# EAGLE design haasoscope_pro_preinput_board (EAGLE 9.6.2)
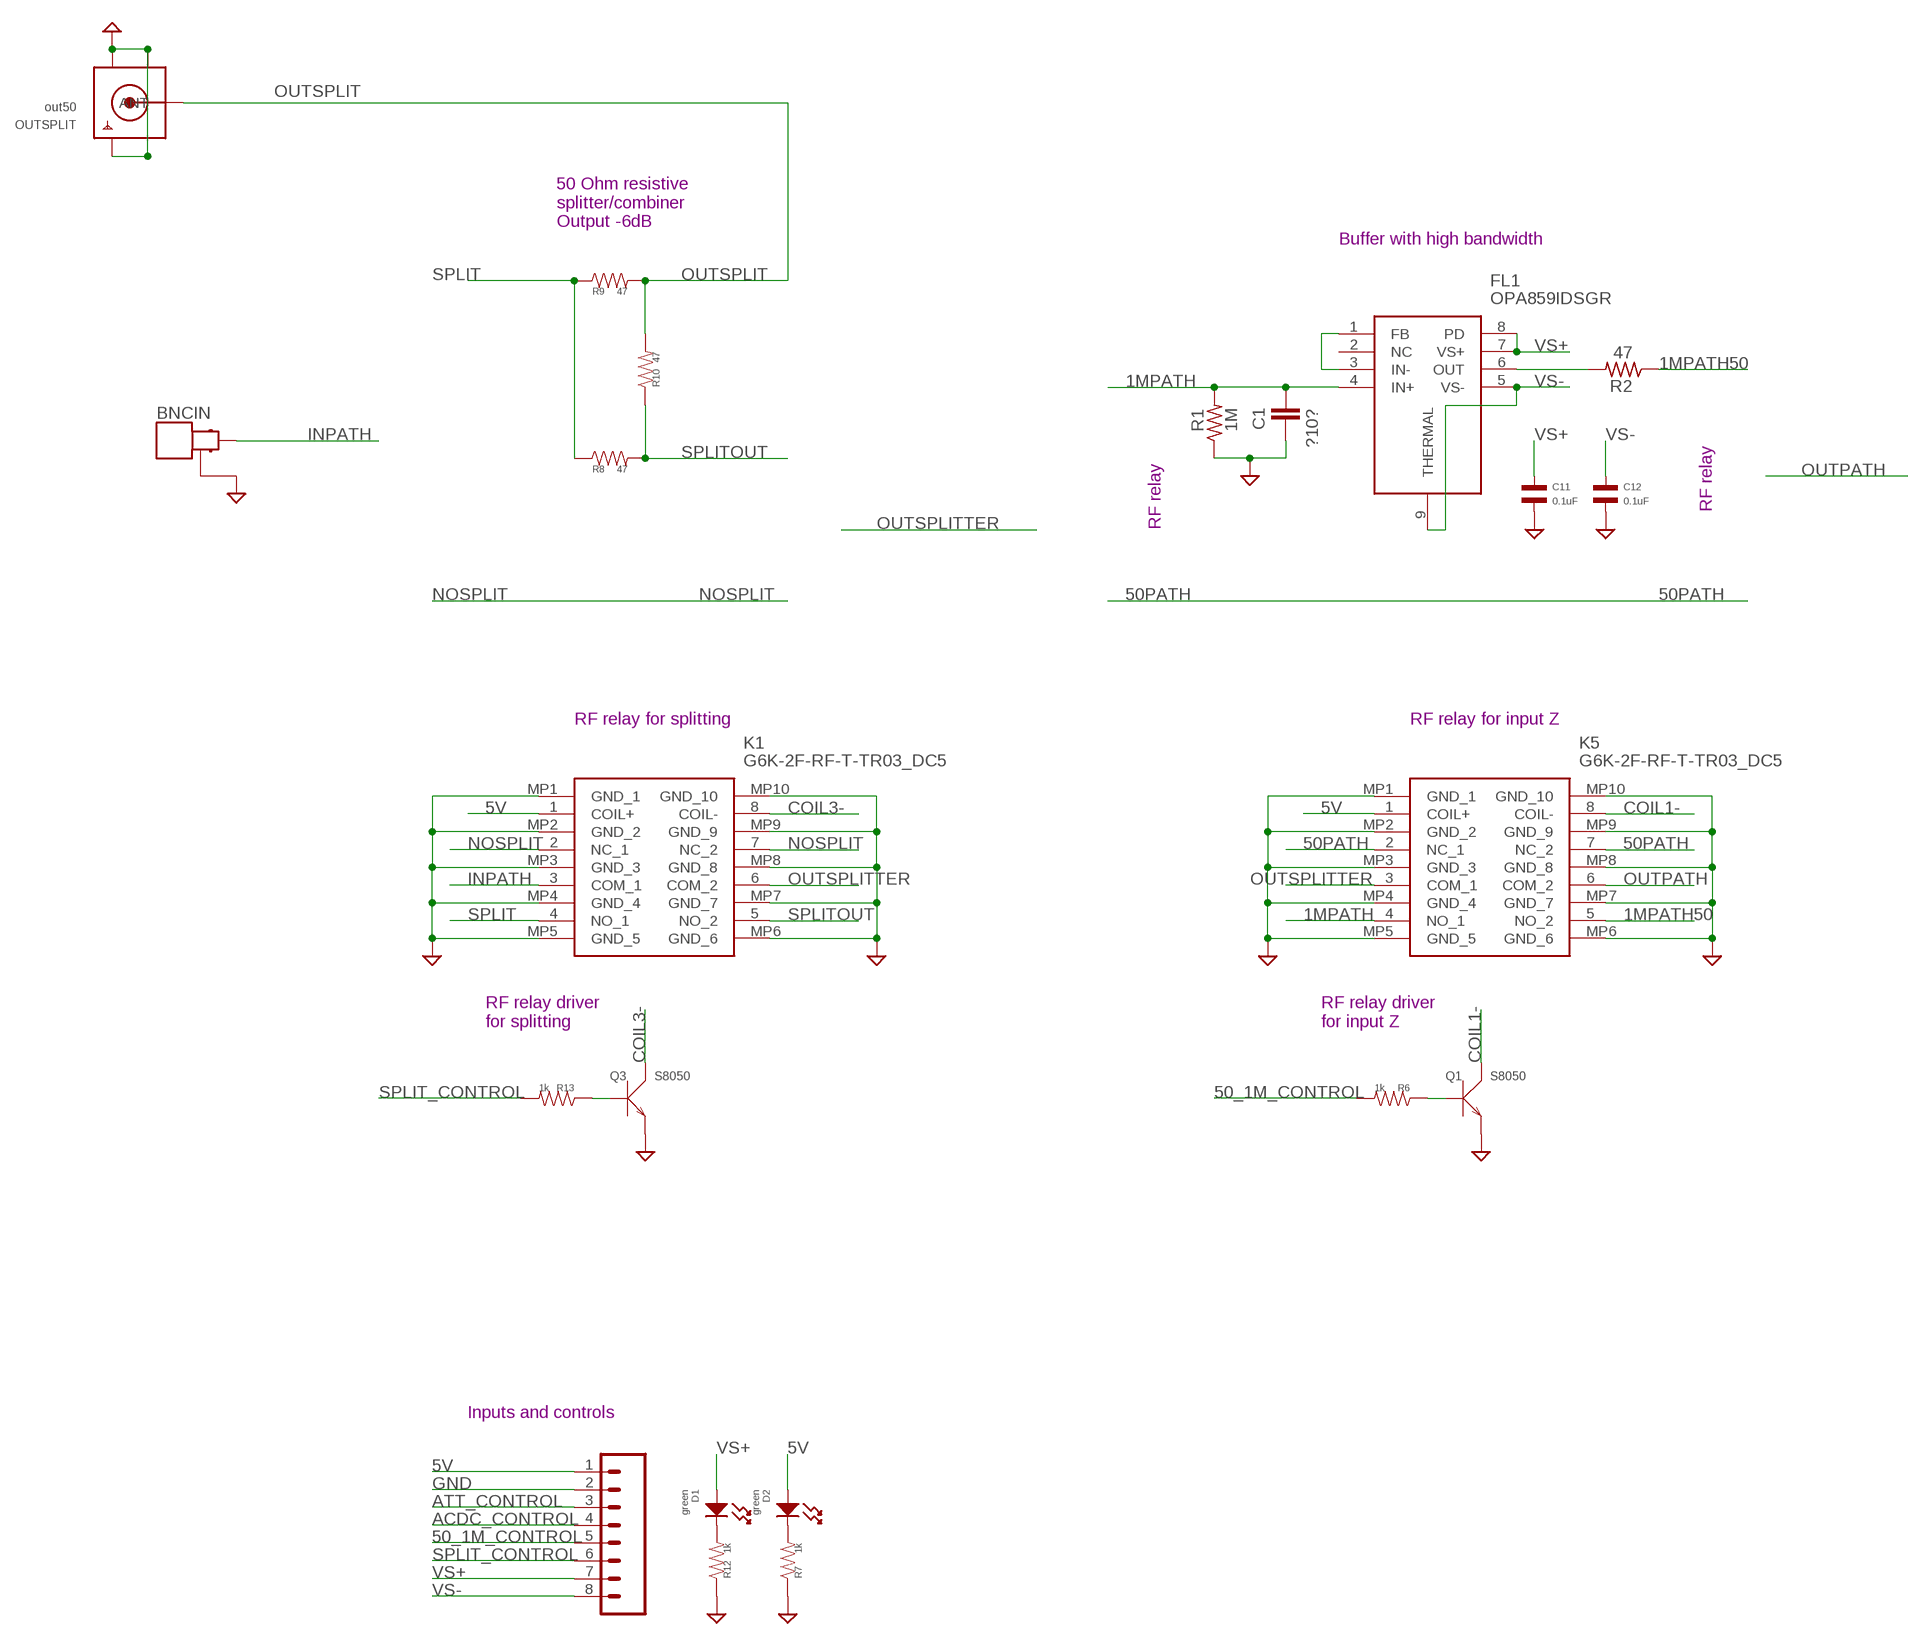
[diagram p0: schematic, sheet 1, part 1 of 2]
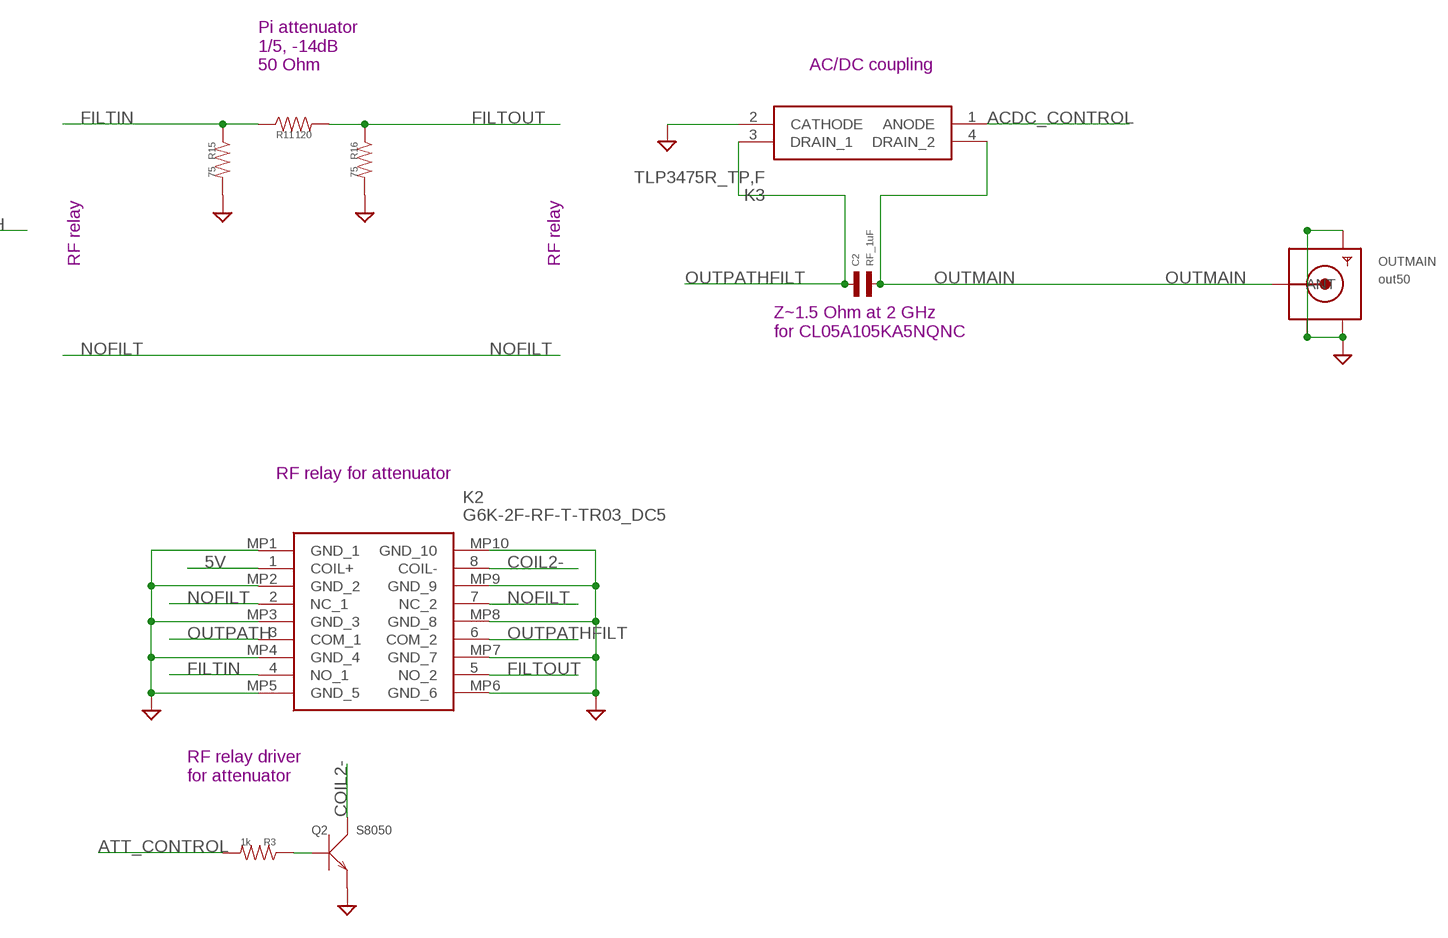
[diagram p1: schematic, sheet 1, part 2 of 2]

## Parts
BNCIN  MOLEX_BNC_73100-0105  [MOLEX-BNC-73100-0105]
C1  ?10?  C-EUC0805  [C0805]
C2  RF_1uF  CAPACITOR_NP_0402  [C0402]
C11  0.1uF  CAPACITOR_NP_0402  [C0402]
C12  0.1uF  CAPACITOR_NP_0402  [C0402]
D1  green  LED_SINGLE-0603  [LED0603]
D2  green  LED_SINGLE-0603  [LED0603]
FL1  OPA859IDSGR  [SON50P200X200X80-9N]
J4  8pin  CONN_08"  [1X08]
K1  G6K-2F-RF-T-TR03_DC5  [G6K2FRFTTR03DC5]
K2  G6K-2F-RF-T-TR03_DC5  [G6K2FRFTTR03DC5]
K3  TLP3475R_TP,F  [TLP3475RTPF]
K5  G6K-2F-RF-T-TR03_DC5  [G6K2FRFTTR03DC5]
OUTMAIN  out50  SMACONNECTOR_EDGE  [SMA_EDGELAUNCH]
OUTSPLIT  out50  SMACONNECTOR_EDGE  [SMA_EDGELAUNCH]
Q1  S8050  SMD-TRANSISTORS-NPN-25V-500MW-S8050(SOT-23)  [SOT-23]
Q2  S8050  SMD-TRANSISTORS-NPN-25V-500MW-S8050(SOT-23)  [SOT-23]
Q3  S8050  SMD-TRANSISTORS-NPN-25V-500MW-S8050(SOT-23)  [SOT-23]
R1  1M  R-US_R0805  [R0805]
R2  47  R-US_R0805  [R0805]
R3  1k  RESISTOR_0402  [R0402]
R6  1k  RESISTOR_0402  [R0402]
R7  1k  RESISTOR_0402  [R0402]
R8  47  RESISTOR_0402  [R0402]
R9  47  RESISTOR_0402  [R0402]
R10  47  RESISTOR_0402  [R0402]
R11  120  RESISTOR_0402  [R0402]
R12  1k  RESISTOR_0402  [R0402]
R13  1k  RESISTOR_0402  [R0402]
R15  75  RESISTOR_0402  [R0402]
R16  75  RESISTOR_0402  [R0402]

## Nets
1MPATH: C1.2 FL1.4(IN+) K5.4(NO_1) R1.2
1MPATH50: K5.5(NO_2) R2.1
5V: D2.ANODE J4.1 K1.1(COIL+) K2.1(COIL+) K5.1(COIL+)
50_1M_CONTROL: J4.5 R6.P$2
50PATH: K5.2(NC_1) K5.7(NC_2)
ACDC_CONTROL: J4.4 K3.1(ANODE)
ATT_CONTROL: J4.3 R3.P$2
COIL1-: K5.8(COIL-) Q1.3(C)
COIL2-: K2.8(COIL-) Q2.3(C)
COIL3-: K1.8(COIL-) Q3.3(C)
FILTIN: K2.4(NO_1) R11.P$1 R15.P$1
FILTOUT: K2.5(NO_2) R11.P$2 R16.P$1
GND: BNCIN.GND1(GND) BNCIN.GND2(GND) C1.1 C11.P$2 C12.P$2 J4.2 K1.MP1(GND_1) K1.MP2(GND_2) K1.MP3(GND_3) K1.MP4(GND_4) K1.MP5(GND_5) K1.MP6(GND_6) K1.MP7(GND_7) K1.MP8(GND_8) K1.MP9(GND_9) K1.MP10(GND_10) K2.MP1(GND_1) K2.MP2(GND_2) K2.MP3(GND_3) K2.MP4(GND_4) K2.MP5(GND_5) K2.MP6(GND_6) K2.MP7(GND_7) K2.MP8(GND_8) K2.MP9(GND_9) K2.MP10(GND_10) K3.2(CATHODE) K5.MP1(GND_1) K5.MP2(GND_2) K5.MP3(GND_3) K5.MP4(GND_4) K5.MP5(GND_5) K5.MP6(GND_6) K5.MP7(GND_7) K5.MP8(GND_8) K5.MP9(GND_9) K5.MP10(GND_10) OUTMAIN.GND@1(GND4) OUTMAIN.GND@2(GND3) OUTMAIN.GND@3(GND2) OUTMAIN.GND@4(GND1) OUTSPLIT.GND@1(GND4) OUTSPLIT.GND@2(GND3) OUTSPLIT.GND@3(GND2) OUTSPLIT.GND@4(GND1) Q1.2(E) Q2.2(E) Q3.2(E) R1.1 R7.P$1 R12.P$1 R15.P$2 R16.P$2
INPATH: BNCIN.SIGNAL K1.3(COM_1)
N$1: D1.CATHODE R12.P$2
N$2: Q2.1(B) R3.P$1
N$3: Q3.1(B) R13.P$1
N$4: FL1.6(OUT) R2.2
N$5: FL1.1(FB) FL1.3(IN-)
N$6: Q1.1(B) R6.P$1
N$7: D2.CATHODE R7.P$2
NOFILT: K2.2(NC_1) K2.7(NC_2)
NOSPLIT: K1.2(NC_1) K1.7(NC_2)
OUTMAIN: C2.P$2 K3.4(DRAIN_2) OUTMAIN.P(ANT)
OUTPATH: K2.3(COM_1) K5.6(COM_2)
OUTPATHFILT: C2.P$1 K2.6(COM_2) K3.3(DRAIN_1)
OUTSPLIT: OUTSPLIT.P(ANT) R9.P$2 R10.P$2
OUTSPLITTER: K1.6(COM_2) K5.3(COM_1)
SPLIT: K1.4(NO_1) R8.P$1 R9.P$1
SPLIT_CONTROL: J4.6 R13.P$2
SPLITOUT: K1.5(NO_2) R8.P$2 R10.P$1
VS+: C11.P$1 D1.ANODE FL1.7(VS+) FL1.8(PD) J4.7
VS-: C12.P$1 FL1.5(VS-) FL1.9(THERMAL) J4.8
Unconnected: FL1.2(NC)

## Notes on the sheet
- 50 Ohm resistive 
  splitter/combiner
  Output -6dB
- Buffer with high bandwidth
- Pi attenuator
  1/5, -14dB
  50 Ohm
- AC/DC coupling
- RF relay | RF relay | RF relay
- RF relay
- Z~1.5 Ohm at 2 GHz
  for CL05A105KA5NQNC
- RF relay for splitting | RF relay for input Z | RF relay for attenuator
- RF relay driver
  for splitting
- RF relay driver
  for input Z
- RF relay driver
  for attenuator
- Inputs and controls

## Library data of the parts
BNCIN = connector:MOLEX_BNC_73100-0105: CONN BNC JACK R/A 50 OHM PCB; DIGIKEY: WM5524-ND; MPN: 73100-0105
C1 = resistor:C-EU: CAPACITOR, European symbol
C2 = MF_Passives:CAPACITOR_NP: Library: MF_Passives Description: Device for Non-Polarized Capacitors. Manufacture part number (MPN) can be added via Attributes. Check https://factory.macrofab.com/parts for the house parts list.; LCSC: C52923; POPULATE: 1
C11 C12 = MF_Passives:CAPACITOR_NP: Library: MF_Passives Description: Device for Non-Polarized Capacitors. Manufacture part number (MPN) can be added via Attributes. Check https://factory.macrofab.com/parts for the house parts list.; POPULATE: 1
D1 D2 = MF_LEDs:LED_SINGLE: Library: MF_LEDs Description: Device for Single LED Packages. Manufacture part number (MFG#) can be added via Attributes.; HOUSEPART: NO; LCSC: C2286; POPULATE: 1
FL1 = OPA859IDSGR:OPA859IDSGR: 1.8 GHz Unity-Gain Bandwidth, 3.3 nV/Hz, FET Input Amplifier Source: Datasheet <http://www.ti.com/lit/gpn/opa859>; DESCRIPTION: 1.8 GHz Unity-Gain Bandwidth, 3.3 nV/Hz, FET Input Amplifier; HEIGHT: 0.8mm; MANUFACTURER_NAME: Texas Instruments; MANUFACTURER_PART_NUMBER: OPA859IDSGR; MOUSER_PART_NUMBER: 595-OPA859IDSGR; MOUSER_PRICE-STOCK: https://www.mouser.co.uk/ProductDetail/Texas-Instruments/OPA859IDSGR?qs=qSfuJ%252Bfl%2Fd54IFp3Wwx4ug%3D%3D
J4 = SparkFun-Connectors:CONN_08: Multi connection point. Often used as Generic Header-pin footprint for 0.1 inch spaced/style header connections On any of the 0.1 inch spaced packages, you can populate with these: Break Away Headers - Straight <https://www.sparkfun.com/products/116> (PRT-00116) Break Away Male Headers - Right Angle <https://www.sparkfun.com/products/553> (PRT-00553) Female Headers <https://www.sparkfun.com/products/115> (PRT-00115) Break Away Headers - Machine Pin <https://www.sparkfun.com/products/117> (PRT-00117) Break Away Female Headers - Swiss Machine Pin <https://www.sparkfun.com/products/743> (PRT-00743) Arduino Stackable Header - 8 Pin <https://www.sparkfun.com/products/9279> (PRT-09279) For SCREWTERMINALS and SPRING TERMINALS visit here: Screw Terimnals on SparkFun.com <https://www.sparkfun.com/search/results?term=Screw+Terminals> (5mm/3.5mm/2.54mm spacing) This device is also useful as a general connection point to wire up your design to another part of your project. Our various solder wires solder well into these plated through hole pads. Hook-Up Wire - Assortment (Stranded, 22 AWG) <https://www.sparkfun.com/products/11375> (PRT-11375) Hook-Up Wire - Assortment (Solid Core, 22 AWG) <https://www.sparkfun.com/products/11367> (PRT-11367) View the entire wire category on our website here <https://www.sparkfun.com/categories/141> Special notes: Molex polarized connector foot print use with SKU : PRT-08231 with associated crimp pins and housings. 1MM SMD Version SKU: PRT-10208 NOTES ON THE VARIANTS LOCK and LOCK_LONGPADS... This footprint was designed to help hold the alignment of a through-hole component (i.e. 6-pin header) while soldering it into place. You may notice that each hole has been shifted either up or down by 0.005 of an inch from it's more standard position (which is a perfectly straight line). This slight alteration caused the pins (the squares in the middle) to touch the edges of the holes. Because they are alternating, it causes a "brace" to hold the component in place. 0.005 has proven to be the perfect amount of "off-center" position when using our standard breakaway headers. Although looks a little odd when you look at the bare footprint, once you have a header in there, the alteration is very hard to notice. Also,if you push a header all the way into place, it is covered up entirely on the bottom side.; PROD_ID: CONN-08438
K1 K2 K5 = G6K-2F-RF-T-TR03_DC5:G6K-2F-RF-T-TR03_DC5: High Frequency / RF Relays 3GHz SpSavGrd NoLtch DPDT 5DC 100mW TR300 Source: Datasheet <http://omronfs.omron.com/en_US/ecb/products/pdf/en-g6k_2f_rf.pdf>; DESCRIPTION: High Frequency / RF Relays 3GHz SpSavGrd NoLtch DPDT 5DC 100mW TR300; HEIGHT: 5.7mm; MANUFACTURER_NAME: Omron Electronics; MANUFACTURER_PART_NUMBER: G6K-2F-RF-T-TR03 DC5; MOUSER_PART_NUMBER: 653-G6K2FRFTTR03DC5; MOUSER_PRICE-STOCK: https://www.mouser.co.uk/ProductDetail/Omron-Electronics/G6K-2F-RF-T-TR03-DC5?qs=bR9%2Fh8%2FHa7Q3LGohyKHVjA%3D%3D
K3 = TLP3475R_TP_F:TLP3475R_TP,F: Solid State Relays - PCB Mount Photorelay Voff=40V Ion=0.12A Ron=14Ohm Source: Datasheet <https://toshiba.semicon-storage.com/info/docget.jsp?did=15250&prodName=TLP3475R>; DESCRIPTION: Solid State Relays - PCB Mount Photorelay Voff=40V Ion=0.12A Ron=14Ohm; HEIGHT: 1.4mm; MANUFACTURER_NAME: Toshiba; MANUFACTURER_PART_NUMBER: TLP3475R(TP,F; MOUSER_PART_NUMBER: 757-TLP3475RTPF; MOUSER_PRICE-STOCK: https://www.mouser.co.uk/ProductDetail/Toshiba/TLP3475RTPF?qs=bYcAidFZG4jqnlmzhh150Q%3D%3D
OUTMAIN OUTSPLIT = adafruit:SMACONNECTOR: SMA Connector 90° DIP SMA Connector, 50 Ohm (4UConnector: 07259)
Q1-Q3 = Seeed-Transistor:SMD-TRANSISTORS-NPN-25V-500MW-S8050(SOT-23): 305010017; LCSC: C7420370; MPN: S8050
R1 R2 = resistor:R-US_: RESISTOR, American symbol
R3 R6-R13 R15 R16 = MF_Passives:RESISTOR: Library: MF_Passives Description: Device for Resistors. Manufacture part number (MPN), Voltage, Tolerance, and Wattage Rating can be added via Attributes. Check https://factory.macrofab.com/parts for the house parts list.; POPULATE: 1

## Net classes
0 default: width 0.203 mm
1 power: width 0.152 mm

## Board
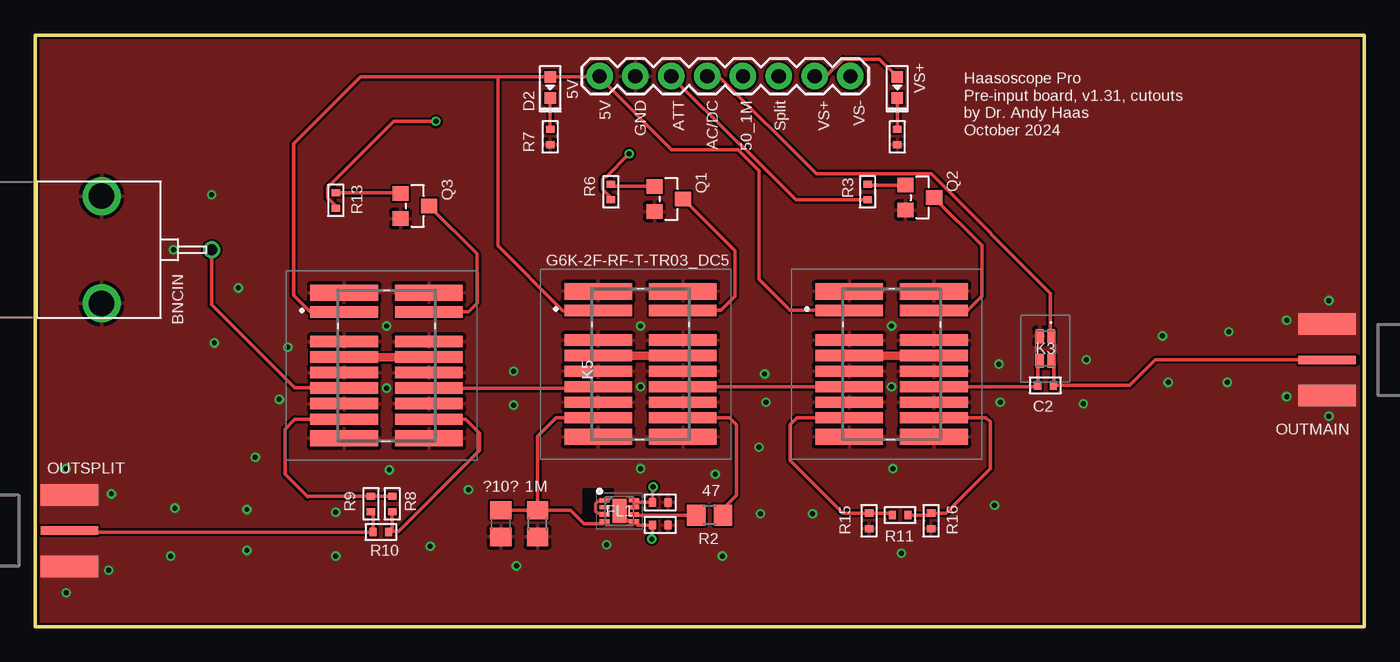
[diagram p2: board, top side]
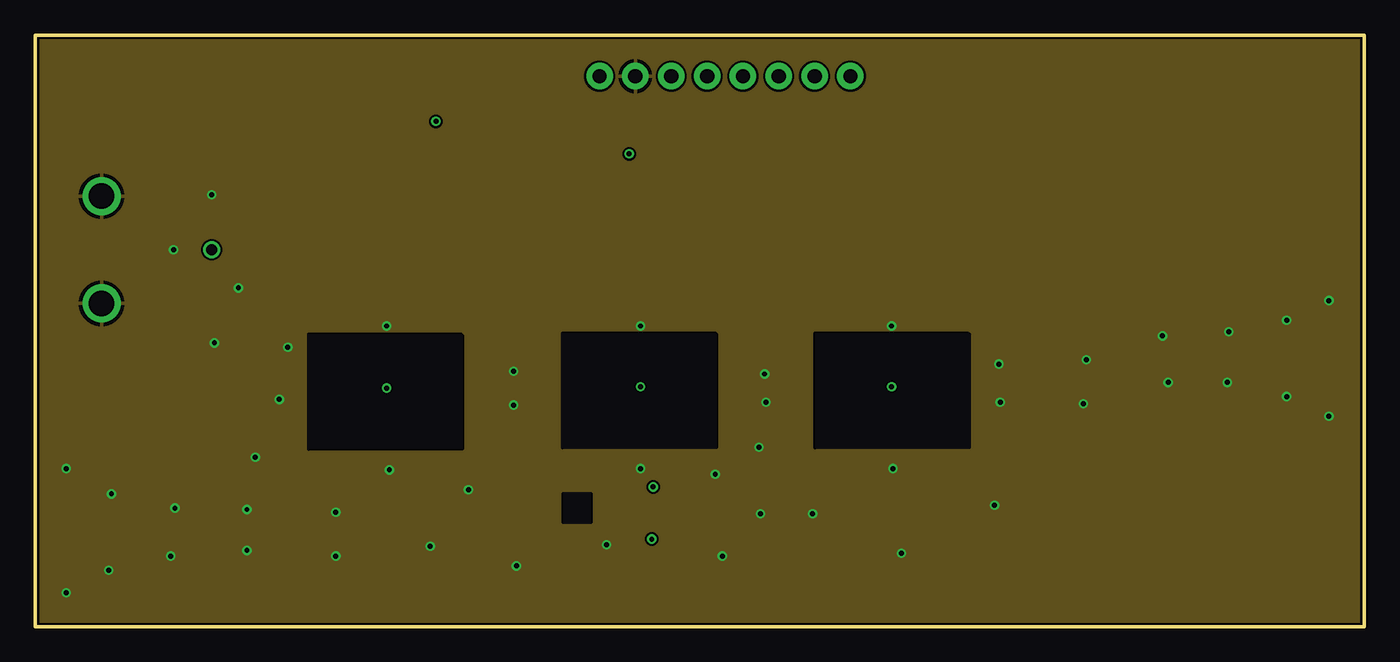
[diagram p3: board, inner layer topgnd]
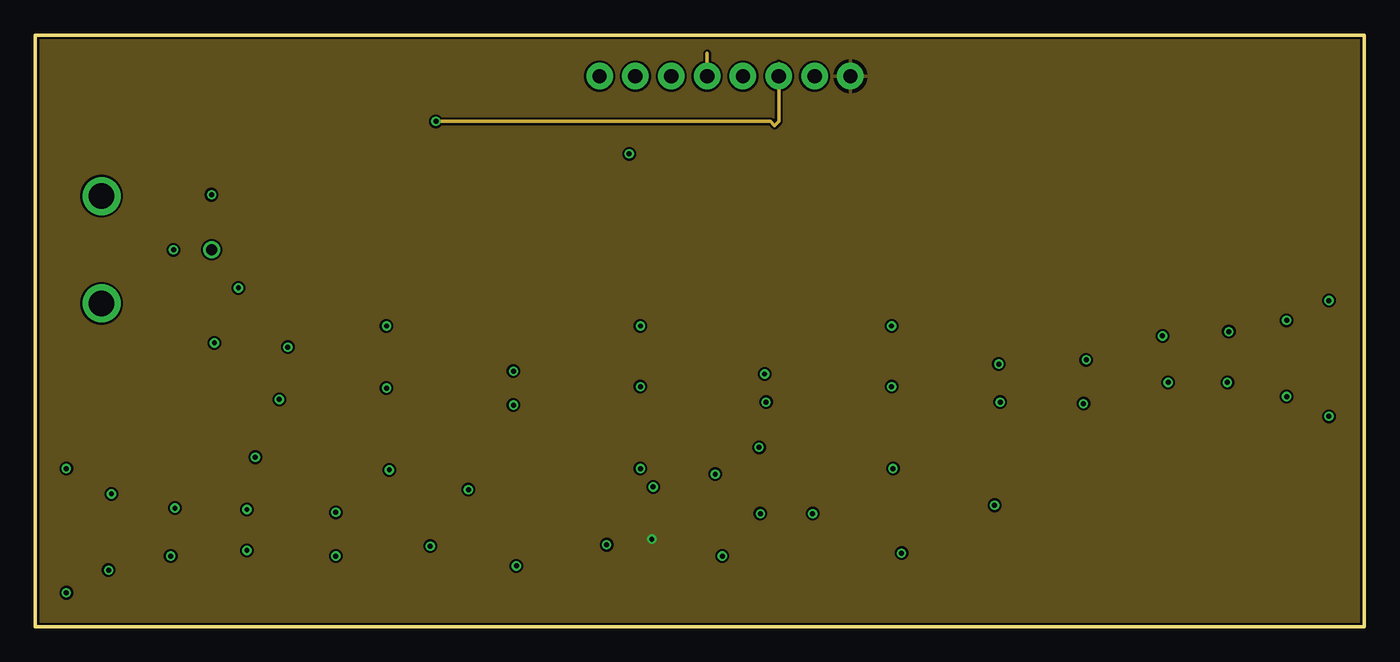
[diagram p4: board, inner layer vsmin]
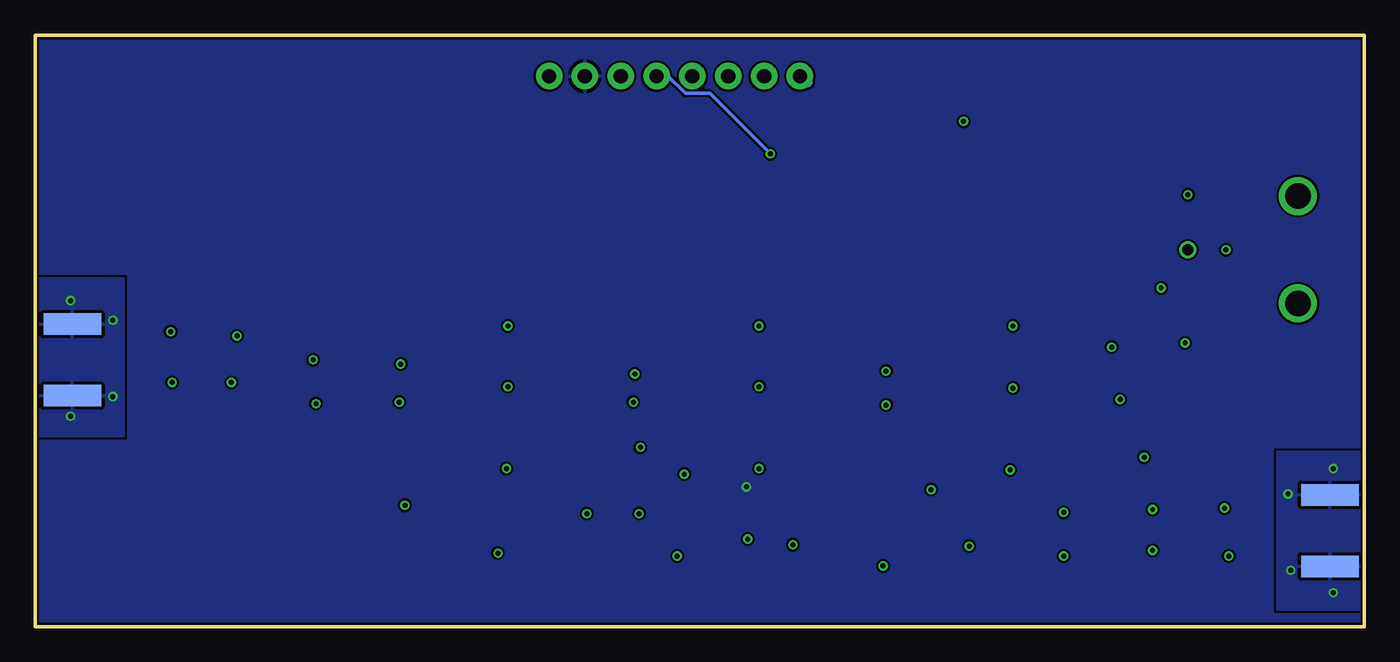
[diagram p5: board, bottom side, seen from below]

Size 94.2 x 41.9 mm. Coordinates in mm from the lower left corner, seen from the top.
Outline: 0,41.9 0,0 94.2,0 94.2,41.9 0,41.9
Copper layers (1*2*15*16): top 0.035mm / dielectric 0.2mm / topgnd 0.0175mm / dielectric 0.3mm / vsmin 0.0175mm / dielectric 0.2mm / vsplus 0.035mm
Design rules "Seeed_AllPCB_MacroFab_haas6mil *": minimum track width 6mil, minimum drill 12mil, track to track 6mil, track to pad 6mil, pad to pad 6mil, via to via 6mil, smd to smd 0mil, copper to edge 6mil, drill to drill 6mil, minimum pad ring 6mil, minimum via ring 6mil, stop-mask expansion 6mil, vias tented up to drill 25mil, thermal gap 10mil

### Footprints (pad centres in the part's own frame; a part is rotated, then mirrored left to right if it is on the bottom)
MOLEX-BNC-73100-0105 = drill 1.8: GND1 -3.8,-3.9; GND2 3.8,-3.9 | drill 0.8: SIGNAL 0,3.9
C0805 = smd 1.3 x 1.5: 1 -0.95,0; 2 0.95,0
C0402 = smd 0.5 x 0.6: P$1 -0.55,0; P$2 0.55,0
LED0603 = smd 0.8 x 0.8: ANODE 0.75,0; CATHODE -0.75,0
SON50P200X200X80-9N = smd 0.7 x 0.3: 1 -1.05,0.75; 2 -1.05,0.25; 3 -1.05,-0.25; 4 -1.05,-0.75; 5 1.05,-0.75; 6 1.05,-0.25; 7 1.05,0.25; 8 1.05,0.75 | smd 1 x 1.7: 9 0,0
1X08 = drill 1.016 pad 1.88: 1 0,0; 2 2.54,0; 3 5.08,0; 4 7.62,0; 5 10.16,0; 6 12.7,0; 7 15.24,0; 8 17.78,0
G6K2FRFTTR03DC5 = smd 0.8 x 4.8: 1 -5.4,-3; 2 -2.2,-3; 3 0,-3; 4 2.2,-3; 5 2.2,3; 6 0,3; 7 -2.2,3; 8 -5.4,3; MP2 -3.3,-3; MP3 -1.1,-3; MP4 1.1,-3; MP7 1.1,3; MP8 -1.1,3; MP9 -3.3,3 | smd 1.15 x 4.8: MP1 -6.75,-3; MP5 3.55,-3; MP6 3.55,3; MP10 -6.75,3
TLP3475RTPF = smd 0.55 x 1: 1 -0.4,-0.875; 2 0.4,-0.875; 3 0.4,0.875; 4 -0.4,0.875
SMA_EDGELAUNCH = smd 4.064 x 1.524: GND@1 2.032,-2.54; GND@2 2.032,2.54 | smd 4.064 x 1.524 bottom: GND@3 2.032,2.54; GND@4 2.032,-2.54 | smd 4.064 x 0.6: P 2.032,0
SOT-23 = smd 1.016 x 1.143: 1 -0.889,-1.016; 2 0.889,-1.016; 3 0,1.016
R0805 = smd 1.3 x 1.5: 1 -0.95,0; 2 0.95,0
R0402 = smd 0.5 x 0.6: P$1 -0.55,0; P$2 0.55,0

### Placement (x,y rotation side)
BNCIN  8.6,26.7 270 top
C1  33,7.3 90 top
C2  71.6,17.1 0 top
C11  44.3,8.8 0 top
C12  44.3,7.2 0 top
D1  61.1,38.2 90 top
D2  36.5,38.2 90 top
FL1  41.4,8.2 0 top
J4  40,39 0 top
K1  24.9,16.9 270 top
K2  60.7,17 270 top
K3  71.6,19.7 180 top
K5  42.9,17 270 top
OUTMAIN  93.6,18.9 180 top
OUTSPLIT  0.4,6.8 0 top
Q1  44.9,30.3 270 top
Q2  62.7,30.4 270 top
Q3  26.9,29.8 270 top
R1  35.6,7.3 90 top
R2  47.8,7.9 180 top
R3  59,30.8 270 top
R6  40.8,30.8 270 top
R7  36.5,34.7 90 top
R8  25.3,8.7 270 top
R9  23.8,8.7 270 top
R10  24.5,6.7 180 top
R11  61.3,7.9 0 top
R12  61.1,34.7 90 top
R13  21.3,30.2 270 top
R15  59.1,7.5 270 top
R16  63.5,7.5 270 top

### Tracks (layer width: path | path; a pad name or v marks a point on that pad's centre or on a via)
1MPATH
  top 0.254: FL1.4 40.2,7.3 38.9,7.3 37.95,8.25 R1.2 | R1.2 C1.2 | K5.4 36.9,14.8 35.6,13.5 R1.2
1MPATH50
  top 0.254: 48.1,8.55 R2.1 48.75,8.35 49.7,9.3 49.7,14.3 49.19,14.81 46.95,14.81 46.94,14.8 K5.5
5V
  top 0.254: 39.95,38.95 D2.ANODE 32.8,38.95 | 39.95,38.95 J4.1 | 37.6,22.4 K5.1 37.38,22.4 32.8,26.98 32.8,38.95 | K1.1 19.48,22.3 18.3,23.48 18.3,34.2 23.05,38.95 32.8,38.95 | K2.1 53.5,22.4 51.3,24.6 51.3,32.3 49.8,33.8 45.1,33.8 39.95,38.95
  vsplus 0.254: 40,39.8 40,39.1 J4.1
  vsplus 0.813: 39.5,38.6 40,39.1
50_1M_CONTROL  (via drill 0.35)
  top 0.254: v42.1,33.5 40.48,31.88 40.38,31.88 40.22,31.72 40.22,30.98 40.8,30.41 R6.P$2
  vsplus 0.254: v42.1,33.5 46.38,37.78 48.12,37.78 49.34,39 J4.5
50PATH
  top 0.254: K5.7 46.5,19.2
  top 0.61: K5.2 K5.7
ACDC_CONTROL
  top 0.254: K3.1 71.95,20.62 71.95,23.64 63.51,32.08 55.36,32.08 48.44,39 J4.4
  vsmin 0.254: 47.62,40.62 J4.4
ATT_CONTROL
  top 0.254: 58.85,30.1 R3.P$2 53.92,30.25 49.97,34.21 49.87,34.21 J4.3
  vsmin 0.254: 45.2,39.12 J4.3
COIL1-
  top 0.254: K5.8 48.6,22.4 49.6,23.4 49.6,26.62 Q1.3
COIL2-
  top 0.254: Q2.3 67.1,27.02 67.1,23.4 66.1,22.4 K2.8
COIL3-
  top 0.254: Q3.3 31.3,26.42 31.3,22.9 30.7,22.3 K1.8
FILTIN
  top 0.254: R11.P$1 60.6,8.05 R15.P$1 57.25,8.05 53.5,11.8 53.5,14.3 54,14.8 K2.4
FILTOUT
  top 0.254: R11.P$2 63.35,7.9 R16.P$1 64.55,8.05 67.7,11.2 67.7,14.5 67.4,14.8 K2.5
GND  (via drill 0.35)
  other vias: 5.2,4 2.2,2.4 5.4,9.4 2.2,11.2 88.7,16.3 91.7,14.9 88.7,21.7 91.7,23.1 33.9,18.1 51.7,17.9 33.9,15.7 51.8,15.9 68.3,18.6 68.4,15.9 17.9,19.8 17.3,16.1 12.7,20.1 14.4,24 12.5,30.6 24.9,21.3 42.9,21.3 60.7,21.3 60.7,17 42.9,17 24.9,16.9 30.7,9.7 25.1,11.1 42.9,11.2 60.8,11.2 21.3,8.1 28,5.7 21.3,5 15,8.3 15,5.4 9.9,8.4 9.6,5 15.6,12 51.4,8 34.1,4.3 40.5,5.8 48.7,5 48.2,10.8 51.3,12.7 55.1,8 61.4,5.2 68,8.6 74.3,15.8 74.5,18.9 79.9,20.6 80.3,17.3 84.6,20.9 84.5,17.3 9.8,26.7
  pour topgnd (isolate 0.152): 97.2,46.4 97.2,-3.2 -4,-3.2 -4,46.4
  pour top (isolate 0.152): -2,-1.7 -2,43.4 -1.5,43.9 95.2,43.9 95.7,43.4 95.7,-1.7
  cutout topgnd: 37.4,9.4 39.4,9.4 39.4,7.4 37.4,7.4
  cutout top: 38.9,9.7 40.9,9.7 40.9,7.7 38.9,7.7
  pour vsplus: 94.3,24.7 94.3,13.5 87.9,13.5 87.9,24.7
  pour vsplus: -0.2,1.2 -0.2,12.4 6.2,12.4 6.2,1.2
  cutout topgnd (isolate 0.16): 19.37,20.7 30.2,20.7 30.3,20.6 30.3,12.6 19.4,12.6 19.37,12.57
  cutout topgnd (isolate 0.16): 37.37,20.8 48.2,20.8 48.3,20.7 48.3,12.7 37.4,12.7 37.37,12.67
  cutout topgnd (isolate 0.16): 55.27,20.8 66.1,20.8 66.2,20.7 66.2,12.7 55.3,12.7 55.27,12.67
INPATH
  top 0.254: K1.3 21.88,16.92 18.38,16.92 12.5,22.8 BNCIN.SIGNAL
N$1
  top 0.254: D1.CATHODE R12.P$2
N$2
  top 0.254: Q2.1 59.06,31.29 R3.P$1
N$3
  top 0.254: R13.P$1 25.82,30.75 Q3.1
N$4
  top 0.254: FL1.6 42.5,7.9 R2.2
N$5
  top 0.254: FL1.1 40.28,8.88 39.88,8.88 39.72,8.72 39.72,8.18 39.88,8.02 40.28,8.02 FL1.3
N$6
  top 0.254: Q1.1 40.96,31.19 R6.P$1
N$7
  top 0.254: D2.CATHODE R7.P$2
NOFILT
  top 0.61: K2.2 K2.7
NOSPLIT
  top 0.61: K1.2 K1.7
OUTMAIN
  top 0.254: K3.4 72.2,18.62 72.2,17.15 C2.P$2 77.59,17.1 79.38,18.9 OUTMAIN.P
OUTPATH
  top 0.254: 45.3,17 K5.6 K2.3
OUTPATHFILT
  top 0.254: K3.3 71.05,18.67 C2.P$1 70.95,17 K2.6
OUTSPLIT
  top 0.254: R9.P$2 23.95,8 R10.P$2 1.9,6.7 2,6.8 OUTSPLIT.P
OUTSPLITTER
  top 0.254: K1.6 39.8,16.9 K5.3
SPLIT
  top 0.254: R8.P$1 R9.P$1 19.35,9.25 19.3,9.2 17.7,10.8 17.7,14 18.4,14.7 K1.4
SPLIT_CONTROL  (via drill 0.35)
  top 0.254: v28.4,35.8 25.4,35.8 20.72,31.12 20.72,30.38 21.3,29.8 R13.P$2
  vsmin 0.254: 52.7,39.9 J4.6 52.7,35.8 52.4,35.5 52.1,35.8 v28.4,35.8
SPLITOUT
  top 0.254: R8.P$2 25.3,6.95 25.1,6.75 | 25.1,6.75 R10.P$1 | K1.5 30.5,14.7 31.5,13.7 31.5,12.5 25.75,6.75 25.1,6.75
VS+  (via drill 0.35)
  top 0.254: J4.7 56.06,39 57.28,40.22 59.83,40.22 D1.ANODE | C11.P$1 43.75,9.65 43.8,9.7 v43.8,9.9 | C11.P$1 42.6,8.8 FL1.8 FL1.7 42.8,8.8 C11.P$1
  pour vsplus (isolate 0.152, rank 2): -1,42.9 95.2,43.3 95.2,-2.4 -1,-2.4
VS-  (via drill 0.35)
  top 0.254: v43.7,6.2 43.75,6.25 C12.P$1 42.7,7.2 FL1.5 42.05,7.45 41.82,7.68 41.82,7.78 FL1.9
  pour vsmin (isolate 0.152, rank 2): -3,45.4 96.2,45.8 96.2,-1 -3,-1

### Text on the board
tPlace: 5V | VS+ | 5V | GND | ATT | AC/DC | 50_1M | Split | VS+ | VS- | Haasoscope Pro / Pre-input board, v1.31, cutouts / by Dr. Andy Haas / October 2024